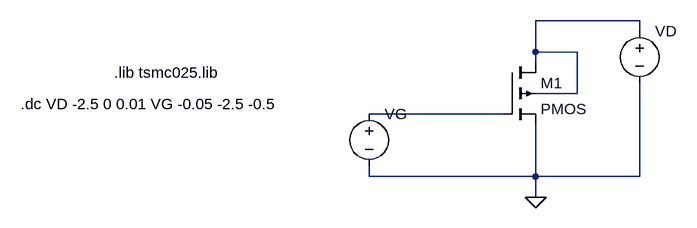
[diagram p0: schematic 250p_IDVD.asc]
250p_IDVD.asc, the LTspice schematic file:
Version 4
SHEET 1 880 680
WIRE 368 64 208 64
WIRE 368 80 368 64
WIRE 208 112 208 64
WIRE 272 112 208 112
WIRE 208 128 208 112
WIRE 272 176 272 112
WIRE 272 176 208 176
WIRE 160 208 -48 208
WIRE -48 304 -48 288
WIRE 208 304 208 224
WIRE 208 304 -48 304
WIRE 368 304 368 160
WIRE 368 304 208 304
WIRE 208 336 208 304
FLAG 208 336 0
SYMBOL pmos4 160 128 R0
SYMATTR InstName M1
SYMATTR Value2 l=240n w=360n
SYMBOL voltage -48 192 R0
WINDOW 123 0 0 Left 0
WINDOW 39 0 0 Left 0
SYMATTR InstName VG
SYMATTR Value ""
SYMBOL voltage 368 64 R0
WINDOW 123 0 0 Left 0
WINDOW 39 0 0 Left 0
SYMATTR InstName VD
SYMATTR Value ""
TEXT -440 144 Left 2 !.lib tsmc025.lib
TEXT -584 192 Left 2 !.dc VD -2.5 0 0.01 VG -0.05 -2.5 -0.5

The netlist it stands for:
* 250p_IDVD.asc
M1 N001 N002 0 N001 PMOS l=240n w=360n
VG N002 0
VD N001 0
.model NMOS NMOS
.model PMOS PMOS
.lib standard.mos
.lib tsmc025.lib
.dc VD -2.5 0 0.01 VG -0.05 -2.5 -0.5
.backanno
.end